# EAGLE design MotioGlove (EAGLE 7.4.0)
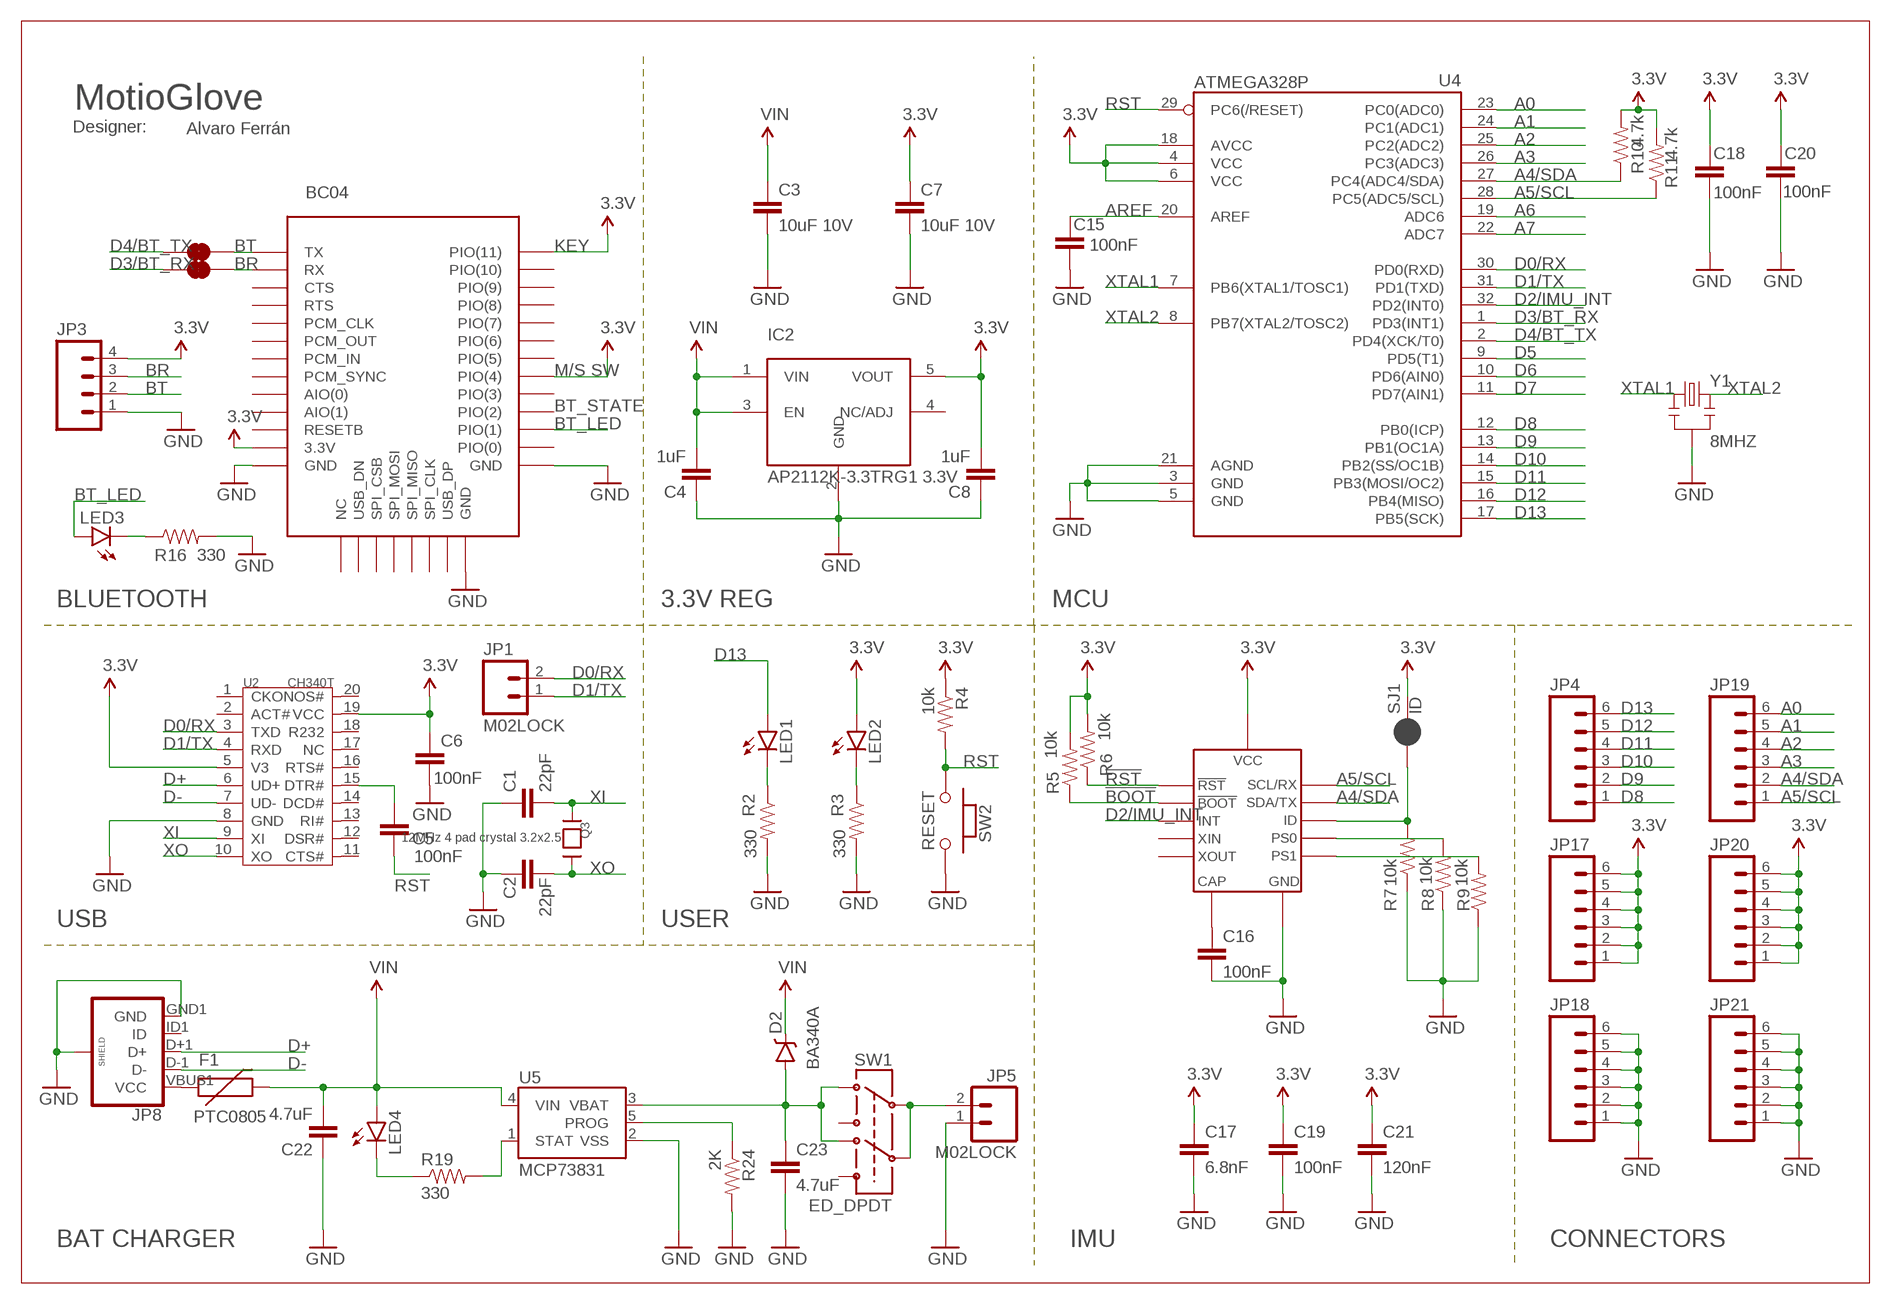
[diagram p0: schematic, sheet 1]

## Parts
C1  22pF  CAP0402-CAP  [0402-CAP]
C2  22pF  CAP0402-CAP  [0402-CAP]
C3  10uF 10V  CAP0603-CAP  [0603-CAP]
C4  1uF  CAP0603-CAP  [0603-CAP]
C5  100nF  CAP0402-CAP  [0402-CAP]
C6  100nF  CAP0402-CAP  [0402-CAP]
C7  10uF 10V  CAP0603-CAP  [0603-CAP]
C8  1uF  CAP0603-CAP  [0603-CAP]
C15  100nF  CAP0402-CAP  [0402-CAP]
C16  100nF  CAP0603-CAP  [0603-CAP]
C17  6.8nF  CAP0603-CAP  [0603-CAP]
C18  100nF  CAP0402-CAP  [0402-CAP]
C19  100nF  CAP0603-CAP  [0603-CAP]
C20  100nF  CAP0402-CAP  [0402-CAP]
C21  120nF  CAP0603-CAP  [0603-CAP]
C22  4.7uF  CAP0402-CAP  [0402-CAP]
C23  4.7uF  CAP0402-CAP  [0402-CAP]
D2  BA340A  B340A  [SMA-DIODE]
F1  PTC0805  [0805]
IC2  AP2112K-3.3TRG1 3.3V  5PIN_REG  [SOT23-5]
IC3  BC04_BLUETOOTH  [BC04]
JP1  M02LOCK  [1X02_LOCK]
JP3  M04LOCK  [1X04_LOCK]
JP4  M06LOCK  [1X06_LOCK]
JP5  M02LOCK  [1X02_LOCK]
JP8  USB_MICROB_PLUGCONN-11752  [USB-B-MICRO-SMD_V03]
JP17  M06LOCK  [1X06_LOCK]
JP18  M06LOCK  [1X06_LOCK]
JP19  M06LOCK  [1X06_LOCK]
JP20  M06LOCK  [1X06_LOCK]
JP21  M06LOCK  [1X06_LOCK]
LED1  LED0603  [LED-0603]
LED2  LED0603  [LED-0603]
LED3  LED0603  [LED-0603]
LED4  LED0603  [LED-0603]
Q3  12MHz 4 pad crystal 3.2x2.5  CRYSTAL3.2X2.5  [CRYSTAL_3.2X2.5]
R  JUMPER-PAD-2-NC_BY_TRACE  [PAD-JUMPER-2-NC_BY_TRACE_YES_SILK]
R2  330  RESISTOR0402-RES  [0402-RES]
R3  330  RESISTOR0402-RES  [0402-RES]
R4  10k  RESISTOR0402-RES  [0402-RES]
R5  10k  RESISTOR0402-RES  [0402-RES]
R6  10k  RESISTOR0402-RES  [0402-RES]
R7  10k  RESISTOR0402-RES  [0402-RES]
R8  10k  RESISTOR0402-RES  [0402-RES]
R9  10k  RESISTOR0402-RES  [0402-RES]
R10  4.7k  RESISTOR0402-RES  [0402-RES]
R11  4.7k  RESISTOR0402-RES  [0402-RES]
R16  330  RESISTOR0402-RES  [0402-RES]
R19  330  RESISTOR0402-RES  [0402-RES]
R24  2K  RESISTOR0402-RES  [0402-RES]
SJ1  ID  JUMPER-PAD-2-NC_BY_PASTE  [PAD-JUMPER-2-NC_BY_PASTE_YES_SILK]
SW1  ED_DPDT  [ED_DPDT]
SW2  RESET  PB157  [157SW]
T  JUMPER-PAD-2-NC_BY_TRACE  [PAD-JUMPER-2-NC_BY_TRACE_YES_SILK]
U2  CH340T  [SSOP20]
U3  BNO055  [BNO055]
U4  ATMEGA328P  ATMEGA328_SMT  [TQFP32-08]
U5  MCP73831  [SOT23-5]
Y1  8MHZ  RESONATOR8MHZ  [RESONATOR-SMD]

## Nets
3.3V: C6.1 C7.1 C8.2 C17.1 C18.1 C19.1 C20.1 C21.1 IC2.5(VOUT) IC3.P$12(3.3V) IC3.P$27(PIO(4)) IC3.P$34(PIO(11)) JP3.4 JP17.1 JP17.2 JP17.3 JP17.4 JP17.5 JP17.6 JP20.1 JP20.2 JP20.3 JP20.4 JP20.5 JP20.6 LED2.A R4.1 R5.2 R6.2 R10.2 R11.2 SJ1.2 U2.5(V3) U2.19(VCC) U3.3(VCC) U3.28(VCC) U4.4(VCC) U4.6(VCC) U4.18(AVCC)
!BOOT: R5.1 U3.4(BOOT)
!RST: R6.1 U3.11(RST)
A0: JP19.6 U4.23(PC0(ADC0))
A1: JP19.5 U4.24(PC1(ADC1))
A2: JP19.4 U4.25(PC2(ADC2))
A3: JP19.3 U4.26(PC3(ADC3))
A4/SDA: JP19.2 R10.1 U3.20(SDA/TX) U4.27(PC4(ADC4/SDA))
A5/SCL: JP19.1 R11.1 U3.19(SCL/RX) U4.28(PC5(ADC5/SCL))
A6: U4.19(ADC6)
A7: U4.22(ADC7)
AREF: C15.1 U4.20(AREF)
BR: IC3.P$2(RX) JP3.3 R.2
BT: IC3.P$1(TX) JP3.2 T.2
BT_LED: IC3.P$24(PIO(1)) LED3.A
D0/RX: JP1.2 U2.3(TXD) U4.30(PD0(RXD))
D1/TX: JP1.1 U2.4(RXD) U4.31(PD1(TXD))
D2/IMU_INT: U3.14(INT) U4.32(PD2(INT0))
D3/BT_RX: R.1 U4.1(PD3(INT1))
D4/BT_TX: T.1 U4.2(PD4(XCK/T0))
D5: U4.9(PD5(T1))
D6: U4.10(PD6(AIN0))
D7: U4.11(PD7(AIN1))
D8: JP4.1 U4.12(PB0(ICP))
D9: JP4.2 U4.13(PB1(OC1A))
D10: JP4.3 U4.14(PB2(SS/OC1B))
D11: JP4.4 U4.15(PB3(MOSI/OC2))
D12: JP4.5 U4.16(PB4(MISO))
D13: JP4.6 LED1.A U4.17(PB5(SCK))
D+: JP8.D+1(D+) U2.6(UD+)
D-: JP8.D-1(D-) U2.7(UD-)
GND: C1.1 C2.1 C3.2 C4.1 C6.2 C7.2 C8.1 C15.2 C16.2 C17.2 C18.2 C19.2 C20.2 C21.2 C22.1 C23.2 IC2.2(GND) IC3.P$13(GND) IC3.P$21(GND) IC3.P$22(GND) JP3.1 JP5.1 JP8.GND1(GND) JP8.SHIELD1(SHIELD) JP8.SHIELD2(SHIELD) JP8.SHIELD3(SHIELD) JP18.1 JP18.2 JP18.3 JP18.4 JP18.5 JP18.6 JP21.1 JP21.2 JP21.3 JP21.4 JP21.5 JP21.6 R2.2 R3.2 R7.1 R8.1 R9.1 R16.2 R24.2 SW2.2 U2.8(GND) U3.2(GND) U3.10(GND) U3.15(GND) U3.16(GND) U3.18(GND) U3.25(GND) U4.3(GND) U4.5(GND) U4.21(AGND) U5.2(VSS) Y1.2
N$1: C5.1 U2.15(DTR#)
N$2: R7.2 SJ1.1 U3.17(ID)
N$3: JP5.2 SW1.2 SW1.5
N$4: F1.1 JP8.VBUS1(VCC)
N$5: R8.2 U3.6(PS0)
N$6: R9.2 U3.5(PS1)
N$7: LED1.C R2.1
N$9: C16.1 U3.9(CAP)
N$10: R19.2 U5.1(STAT)
N$11: LED3.C R16.1
N$14: LED4.C R19.1
N$18: LED2.C R3.1
PROG: R24.1 U5.5(PROG)
RST: C5.2 R4.2 SW2.1 U4.29(PC6(/RESET))
VBAT: C23.1 D2.A SW1.1 SW1.4 U5.3(VBAT)
VIN: C3.1 C4.2 C22.2 D2.C F1.2 IC2.1(VIN) IC2.3(EN) LED4.A U5.4(VIN)
XI: C1.2 Q3.3 U2.9(XI)
XO: C2.2 Q3.1 U2.10(XO)
XTAL1: U4.7(PB6(XTAL1/TOSC1)) Y1.1
XTAL2: U4.8(PB7(XTAL2/TOSC2)) Y1.3
Unconnected: IC2.4(NC/ADJ) IC3.P$3(CTS) IC3.P$4(RTS) IC3.P$5(PCM_CLK) IC3.P$6(PCM_OUT) IC3.P$7(PCM_IN) IC3.P$8(PCM_SYNC) IC3.P$9(AIO(0)) IC3.P$10(AIO(1)) IC3.P$11(RESETB) IC3.P$14(NC) IC3.P$15(USB_DN) IC3.P$16(SPI_CSB) IC3.P$17(SPI_MOSI) IC3.P$18(SPI_MISO) IC3.P$19(SPI_CLK) IC3.P$20(USB_DP) IC3.P$23(PIO(0)) IC3.P$25(PIO(2)) IC3.P$26(PIO(3)) IC3.P$28(PIO(5)) IC3.P$29(PIO(6)) IC3.P$30(PIO(7)) IC3.P$31(PIO(8)) IC3.P$32(PIO(9)) IC3.P$33(PIO(10)) JP8.ID1(ID) SW1.3 SW1.6 U2.1(CKO) U2.2(ACT#) U2.11(CTS#) U2.12(DSR#) U2.13(RI#) U2.14(DCD#) U2.16(RTS#) U2.17(NC) U2.18(R232) U2.20(NOS#) U3.26(XOUT) U3.27(XIN)

## Notes on the sheet
- MotioGlove
- Designer: | Alvaro Ferrán
- BC04
- KEY
- M/S SW
- BT_STATE
- BLUETOOTH | 3.3V REG | MCU
- USB | USER
- BAT CHARGER | IMU | CONNECTORS

## Library data of the parts
C1-C8 C15-C23 = SparkFun-Passives:CAP: Capacitor Standard 0603 ceramic capacitor, and 0.1" leaded capacitor.
D2 = SparkFun-DiscreteSemi:B340A: Schottky Diode 3A-40V; PROD_ID: DIO-09886
F1 = pighiXXX:PTC0805
IC2 = GHI:5PIN_REG
IC3 = bc04:BC04_BLUETOOTH; IC: BC04
JP1 JP5 = SparkFun-Connectors:M02: Standard 2-pin 0.1" header. Use with - straight break away headers ( PRT-00116) - right angle break away headers (PRT-00553) - swiss pins (PRT-00743) - machine pins (PRT-00117) - female headers (PRT-00115) Molex polarized connector foot print use with: PRT-08233 with associated crimp pins and housings. 2.54_SCREWTERM for use with PRT-10571. 3.5mm Screw Terminal footprints for PRT-08084 5mm Screw Terminal footprints for use with PRT-08432
JP3 = SparkFun-Connectors:M04: Header 4 Standard 4-pin 0.1" header. Use with straight break away headers (SKU : PRT-00116), right angle break away headers (PRT-00553), swiss pins (PRT-00743), machine pins (PRT-00117), and female headers (PRT-00115). Molex polarized connector foot print use with SKU : PRT-08231 with associated crimp pins and housings. 1MM SMD Version SKU: PRT-10208
JP4 JP17-JP21 = SparkFun-Connectors:M06: Header 6 Standard 6-pin 0.1" header. Use with straight break away headers (SKU : PRT-00116), right angle break away headers (PRT-00553), swiss pins (PRT-00743), machine pins (PRT-00117), and female headers (PRT-00115). Molex polarized connector foot print use with SKU : PRT-08094 with associated crimp pins and housings. NOTES ON THE VARIANTS LOCK and LOCK_LONGPADS... This footprint was designed to help hold the alignment of a through-hole component (i.e. 6-pin header) while soldering it into place. You may notice that each hole has been shifted either up or down by 0.005 of an inch from it's more standard position (which is a perfectly straight line). This slight alteration caused the pins (the squares in the middle) to touch the edges of the holes. Because they are alternating, it causes a "brace" to hold the component in place. 0.005 has proven to be the perfect amount of "off-center" position when using our standard breakaway headers. Although looks a little odd when you look at the bare footprint, once you have a header in there, the alteration is very hard to notice. Also,if you push a header all the way into place, it is covered up entirely on the bottom side. This idea of altering the position of holes to aid alignment will be further integrated into the Sparkfun Library for other footprints. It can help hold any component with 3 or more connection pins.
JP8 = SparkFun-Connectors:USB_MICROB_PLUG: USB Micro-B connectors Some male, some female. Watch your step!; PROD_ID: CONN-11752
LED1-LED4 = SparkFun-LED:LED: LEDs Standard schematic elements and footprints for 5mm, 3mm, 1206, and 0603 sized LEDs. 5mm - Spark Fun Electronics SKU : COM-00529 (and others)
Q3 = GHI:CRYSTAL3.2X2.5
R T = SparkFun-Passives:JUMPER-PAD-2-NC_BY_TRACE
R2-R11 R16 R19 R24 = SparkFun-Passives:RESISTOR: Resistor Basic schematic elements and footprints for 0603, 1206, and PTH resistors.
SJ1 = SparkFun-Passives:JUMPER-PAD-2-NC_BY_PASTE
SW1 = pighiXXX:ED_DPDT
SW2 = MySMD:PB157
U2 = template:CH340T
U3 = alvaroferran:BNO055: The BNO055 is a System in Package (SiP), integrating a triaxial 14-bit accelerometer, a triaxial 16-bit gyroscope with a range of ±2000 degrees per second, a triaxial geomagnetic sensor and a 32-bit microcontroller running the company’s BSX3.0 FusionLib software. At just 5.2 x 3.8 x 1.1 mm3, it is significantly smaller than comparable discrete or system-on-board solutions.
U4 = SparkFun-DigitalIC:ATMEGA328_SMT: 32-Pin Atmega328 part Commonly used on Arduino compatible boards Available in QFP and QFN packages TQFP is IC-09069 QFN is non-stock; PROD_ID: IC-09069
U5 = SparkFun-PowerIC:MCP73831: Miniature single cell, fully integrated Li-Ion, Li-polymer charge management controller http://ww1.microchip.com/downloads/en/DeviceDoc/21984a.pdf IC-09995; PROD_ID: IC-09995
Y1 = SparkFun-FreqCtrl:RESONATOR: Resonator Small SMD resonator. Used, eg, on the Arduino Pro/ Pro Mini boards. 8MHz- XTAL-08895 16MHz- XTAL-08900; PROD_ID: XTAL-08895

## Net classes
0 default: width 0.254 mm, drill 0.254 mm, clearance 0.203 mm

## Board
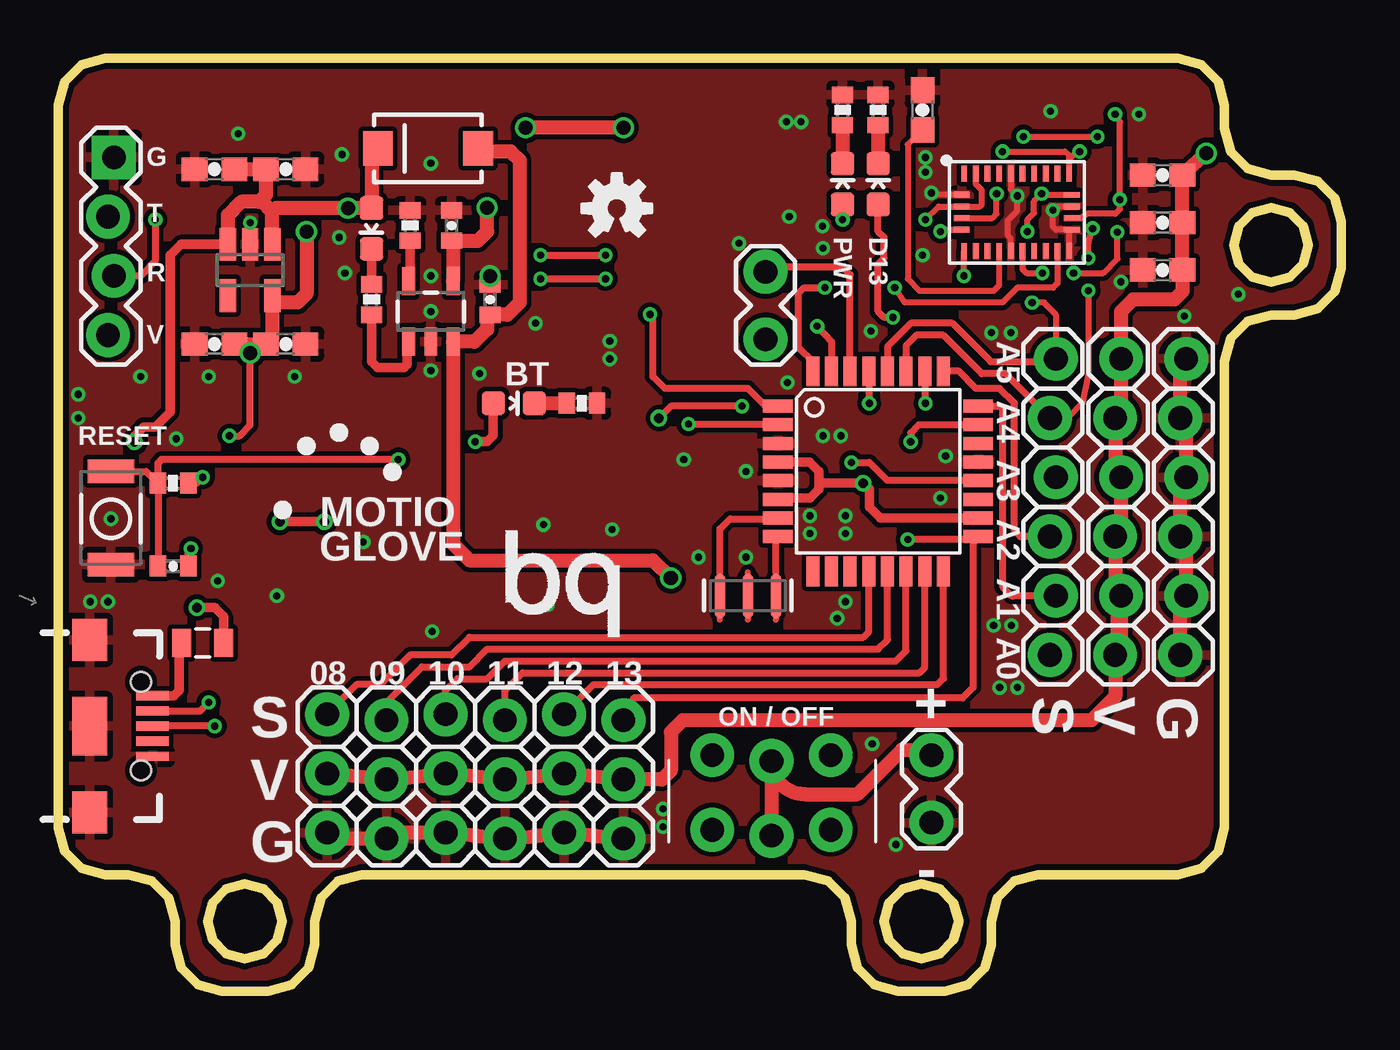
[diagram p1: board, top side]
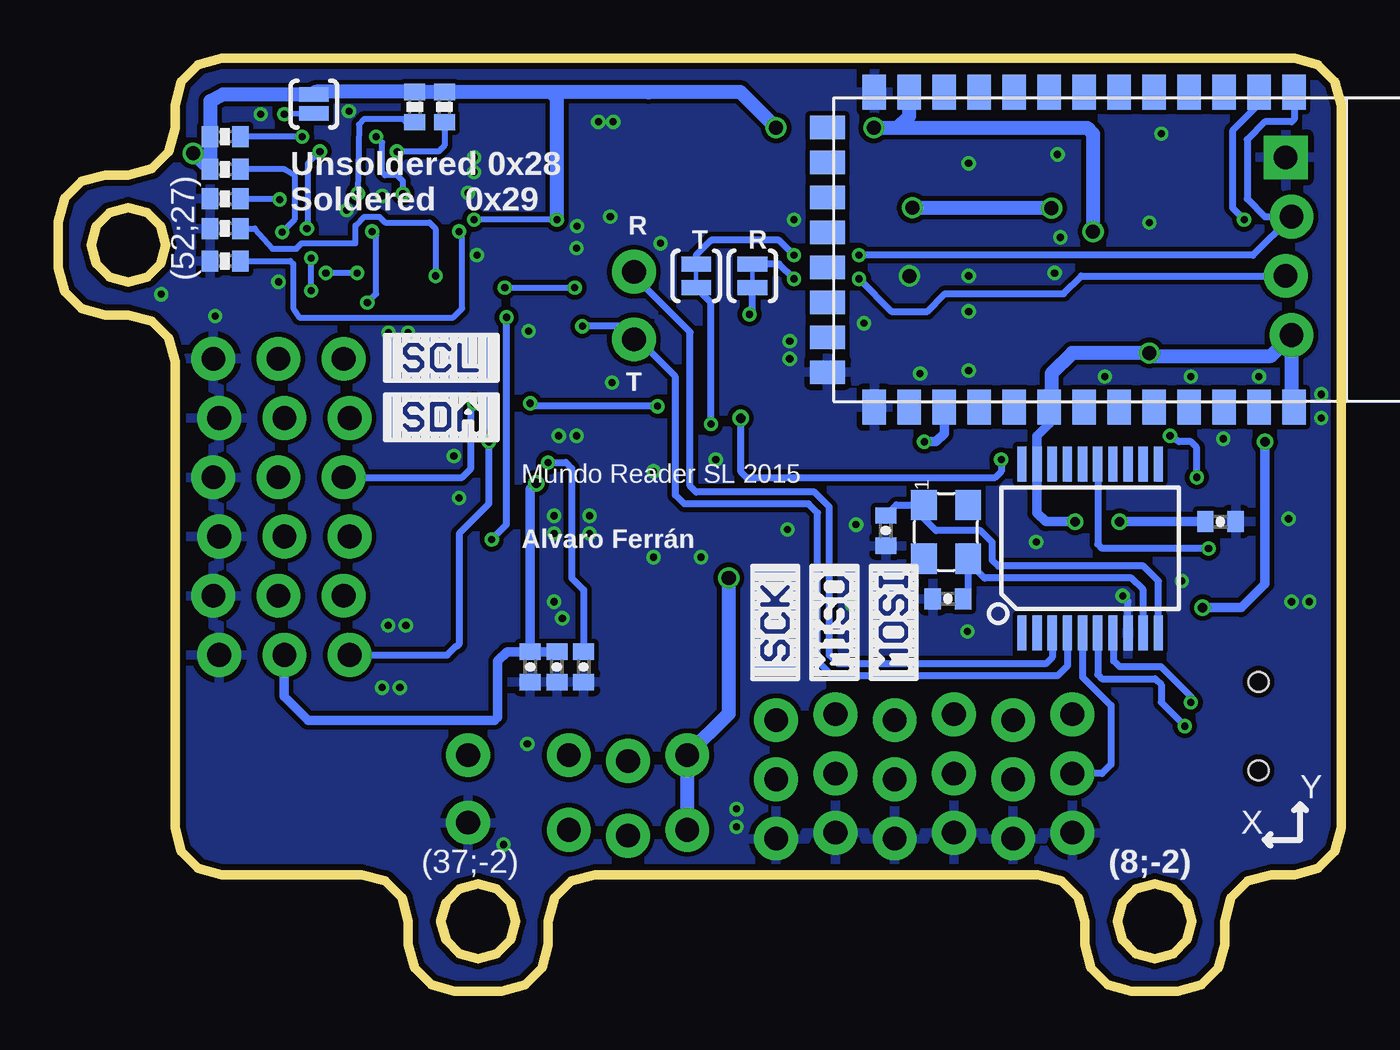
[diagram p2: board, bottom side, seen from below]

Size 55 x 40 mm. Coordinates in mm from the lower left corner, seen from the top.
Outline: 9.39,2.2 9.6,3 9.39,3.8 8.8,4.39 8,4.6 7.2,4.39 6.61,3.8 6.4,3 6.61,2.2 7.2,1.61 8,1.4 8.8,1.61 9.39,2.2
Outline: 38.39,2.2 38.6,3 38.39,3.8 37.8,4.39 37,4.6 36.2,4.39 35.61,3.8 35.4,3 35.61,2.2 36.2,1.61 37,1.4 37.8,1.61 38.39,2.2
Outline: 53.39,31.2 53.6,32 53.39,32.8 52.8,33.39 52,33.6 51.2,33.39 50.61,32.8 50.4,32 50.61,31.2 51.2,30.62 52,30.4 52.8,30.62 53.39,31.2
Outline: 40.27,4 40,3 40,2 39.73,1 39,0.27 38,0 36,0 35,0.27 34.27,1 34,2 34,3 33.73,4 33,4.73 32,5 13,5 12,4.73 11.27,4 11,3 11,2 10.73,1 10,0.27 9,0 7,0 6,0.27 5.27,1 5,2 5,3 4.73,4 4,4.73 3,5 2,5 1,5.27 0.27,6 0,7 0,38 0.27,39 1,39.73 2,40 48,40 49,39.73 49.73,39 50,38 50,37 50.27,36 51,35.27 52,35 53,35 54,34.73 54.73,34 55,33 55,31 54.73,30 54,29.27 53,29 52,29 51,28.73 50.27,28 50,27 50,7 49.73,6 49,5.27 48,5 42,5 41,4.73 40.27,4
Copper layers (1*16): Top 0.035mm / dielectric 1.5mm / Bottom 0.035mm
Design rules "pighixxx_CAM_DRC_V1.0": minimum track width 6mil, minimum drill 12mil, track to track 6mil, track to pad 6mil, pad to pad 6mil, via to via 6mil, smd to smd 0mil, copper to edge 10mil, drill to drill 10mil, minimum pad ring 10mil, minimum via ring 6mil, stop-mask expansion 2mil, vias tented up to drill 100mil, thermal gap 10mil

### Footprints (pad centres in the part's own frame; a part is rotated, then mirrored left to right if it is on the bottom)
0402-CAP = smd 0.7 x 0.9: 1 -0.65,0; 2 0.65,0
0603-CAP = smd 1.1 x 1: 1 -0.85,0; 2 0.85,0
SMA-DIODE = smd 1.27 x 1.47: A -2.15,0; C 2.15,0
0805 = smd 0.8 x 1.2: 1 -0.9,0; 2 0.9,0
SOT23-5 = smd 0.7 x 1.4: 1 0.95,1.1; 2 0,1.1; 3 -0.95,1.1; 4 -0.95,-1.1; 5 0.95,-1.1
BC04 = smd 1 x 1.5: P$1 7,-0.25; P$2 8.5,-0.25; P$3 10,-0.25; P$4 11.5,-0.25; P$5 13,-0.25; P$6 14.5,-0.25; P$7 16,-0.25; P$8 17.5,-0.25; P$9 19,-0.25; P$10 20.5,-0.25; P$11 22,-0.25; P$12 23.5,-0.25; P$13 25,-0.25; P$22 25,13.25; P$23 23.5,13.25; P$24 22,13.25; P$25 20.5,13.25; P$26 19,13.25; P$27 17.5,13.25; P$28 16,13.25; P$29 14.5,13.25; P$30 13,13.25; P$31 11.5,13.25; P$32 10,13.25; P$33 8.5,13.25; P$34 7,13.25 | smd 1.5 x 1: P$14 27,1.25; P$15 27,2.75; P$16 27,4.25; P$17 27,5.75; P$18 27,7.25; P$19 27,8.75; P$20 27,10.25; P$21 27,11.75
1X02_LOCK = drill 1.016 pad 1.88: 1 -0.178,0; 2 2.718,0
1X04_LOCK = drill 1.016 pad 1.88 square: 1 0,0.127 | drill 1.016 pad 1.88: 2 2.54,-0.127; 3 5.08,0.127; 4 7.62,-0.127
1X06_LOCK = drill 1.016 pad 1.88: 1 0,0; 2 2.54,-0.254; 3 5.08,0; 4 7.62,-0.254; 5 10.16,0; 6 12.7,-0.254
USB-B-MICRO-SMD_V03 = smd 1.4 x 0.4: D+1 2.7,0; D-1 2.7,0.65; GND1 2.7,-1.3; ID1 2.7,-0.65; VBUS1 2.7,1.3 | smd 1.5 x 1.8: SHIELD1 0,3.7; SHIELD2 0,-3.7 | smd 1.5 x 2.5: SHIELD3 0,0 | hole 0.85: 2.2,1.9; 2.2,-1.9
LED-0603 = smd 1 x 1: A 0,-0.877; C 0,0.877
CRYSTAL_3.2X2.5 = smd 1.3 x 1.1: 1 -1.1,-0.9; 2 1.2,-0.9; 3 1.2,1; 4 -1.1,1
PAD-JUMPER-2-NC_BY_TRACE_YES_SILK = smd 0.635 x 1.27: 1 -0.508,0; 2 0.508,0
0402-RES = smd 0.7 x 0.9: 1 -0.65,0; 2 0.65,0
PAD-JUMPER-2-NC_BY_PASTE_YES_SILK = smd 0.635 x 1.27: 1 -0.401,0; 2 0.413,0
ED_DPDT = drill 1.016 pad 1.88: 1 -2.54,-1.397; 2 0,-1.651; 3 2.54,-1.397; 4 -2.54,1.803; 5 0,1.549; 6 2.54,1.803
157SW = smd 1.016 x 1.981: 1 0,0; 2 4,0
SSOP20 = smd 0.4 x 1.5: 1 -2.925,-3.625; 2 -2.275,-3.625; 3 -1.625,-3.625; 4 -0.975,-3.625; 5 -0.325,-3.625; 6 0.325,-3.625; 7 0.975,-3.625; 8 1.625,-3.625; 9 2.275,-3.625; 10 2.925,-3.625; 11 2.925,3.625; 12 2.275,3.625; 13 1.625,3.625; 14 0.975,3.625; 15 0.325,3.625; 16 -0.325,3.625; 17 -0.975,3.625; 18 -1.625,3.625; 19 -2.275,3.625; 20 -2.925,3.625
BNO055 = smd 0.25 x 0.68: 1 -2.279,1.72; 6 -2.279,-1.606; 7 -1.779,-1.606; 8 -1.279,-1.606; 9 -0.779,-1.606; 10 -0.279,-1.606; 11 0.221,-1.606; 12 0.721,-1.606; 13 1.221,-1.606; 14 1.721,-1.606; 15 2.221,-1.606; 20 2.221,1.72; 21 1.721,1.72; 22 1.221,1.72; 23 0.721,1.72; 24 0.221,1.72; 25 -0.279,1.72; 26 -0.779,1.72; 27 -1.279,1.72; 28 -1.779,1.72 | smd 0.68 x 0.25: 2 -2.387,0.809; 3 -2.387,0.309; 4 -2.387,-0.191; 5 -2.387,-0.691; 16 2.332,-0.692; 17 2.332,-0.192; 18 2.332,0.308; 19 2.332,0.808
TQFP32-08 = smd 1.27 x 0.559: 1 -4.293,2.8; 2 -4.293,2; 3 -4.293,1.2; 4 -4.293,0.4; 5 -4.293,-0.4; 6 -4.293,-1.2; 7 -4.293,-2; 8 -4.293,-2.8; 17 4.293,-2.8; 18 4.293,-2; 19 4.293,-1.2; 20 4.293,-0.4; 21 4.293,0.4; 22 4.293,1.2; 23 4.293,2; 24 4.293,2.8 | smd 0.559 x 1.27: 9 -2.8,-4.293; 10 -2,-4.293; 11 -1.2,-4.293; 12 -0.4,-4.293; 13 0.4,-4.293; 14 1.2,-4.293; 15 2,-4.293; 16 2.8,-4.293; 25 2.8,4.293; 26 2,4.293; 27 1.2,4.293; 28 0.4,4.293; 29 -0.4,4.293; 30 -1.2,4.293; 31 -2,4.293; 32 -2.8,4.293
SOT23-5' = smd 0.55 x 1.2: 1 -0.95,-1.3; 2 0,-1.3; 3 0.95,-1.3; 4 0.95,1.3; 5 -0.95,1.3
RESONATOR-SMD = smd 0.45 x 1.905: 1 -1.2,0; 2 0,0; 3 1.2,0

### Placement (x,y rotation side)
C1  16.86,16.83 0 bottom
C2  19.53,19.75 90 bottom
C3  9.75,35.24 0 top
C4  6.7,35.24 0 top
C5  4.92,18.23 180 top
C6  5.18,20.13 0 bottom
C7  9.75,27.75 0 top
C8  6.7,27.75 0 top
C15  32.48,13.91 270 bottom
C16  37.05,37.78 90 top
C17  47.34,34.99 180 top
C18  33.62,13.91 270 bottom
C19  47.34,32.96 180 top
C20  34.77,13.91 270 bottom
C21  47.34,30.93 180 top
C22  16.86,32.83 270 top
C23  18.51,29.66 90 top
D2  15.84,36.13 180 top
F1  6.19,14.92 0 top
IC2  8.22,30.93 0 top
IC3  -4.98,38.29 180 bottom
JP1  30.32,28.13 90 top
JP3  2.25,35.75 270 top
JP4  11.53,11.88 0 top
JP5  37.43,7.41 90 top
JP8  1.34,11.37 0 top
JP17  11.53,9.34 0 top
JP18  11.53,6.8 0 top
JP19  42.77,27.12 270 top
JP20  45.31,14.42 90 top
JP21  48.1,14.42 90 top
LED1  35.15,34.61 0 top
LED2  33.62,34.61 0 top
LED3  19.53,25.21 270 top
LED4  13.43,32.7 180 top
Q3  16.99,19.75 270 bottom
R  25.24,30.67 90 bottom
R2  35.15,37.78 90 top
R3  33.62,37.78 90 top
R4  4.92,21.78 180 top
R5  47.85,36.64 180 bottom
R6  47.85,35.24 180 bottom
R7  47.85,33.97 0 bottom
R8  47.85,32.7 0 bottom
R9  47.85,31.31 0 bottom
R10  38.45,37.91 90 bottom
R11  39.72,37.91 90 bottom
R16  22.45,25.21 0 top
R19  13.43,29.66 270 top
R24  15.08,32.83 90 top
SJ1  44.04,38.04 90 bottom
SW1  30.58,8.32 0 top
SW2  2.25,22.29 270 top
T  27.65,30.67 90 bottom
U2  10.76,18.99 0 bottom
U3  41.12,33.34 0 top
U4  35.15,22.29 0 top
U5  MCP73831  [SOT23-5']  15.97,29.15 0 top
U$1  [BQ_LOGO_1]  21.56,16.19 0 top
U$2  [S_SDA]  40.99,25.59 270 bottom
U$3  [OSHW-LOGO-S]  23.95,33.57 0 top
U$4  [BQ_LOGO_SMALL_2]  9.24,20 0 top
U$5  [S_SCL]  40.99,28.13 270 bottom
U$6  [S_MOSI]  20.16,13.4 0 bottom
U$7  [S_MISO]  22.7,13.4 0 bottom
U$8  [S_SCK]  25.24,13.4 0 bottom
Y1  29.56,16.96 0 top

### Tracks (layer width: path | path; a pad name or v marks a point on that pad's centre or on a via)
3.3V  (via drill 0.3, 0.41, 0.6, 0.61)
  Top 0.254: v37.18,33.09 37.74,33.65 U3.3 39.52,33.65 39.59,33.72 39.59,34.36 39.34,34.61 U3.28
  Top 0.305: R4.1 5.94,21.78 v6.19,22.04 | v7.33,23.81 7.77,23.81 8.22,24.27 v8.22,27.37
  Top 0.406: U4.4 32.21,22.69 32.61,22.29 32.61,21.91 | 32.61,21.91 32.61,21.53 32.23,21.15 30.91,21.15 U4.6 | 32.61,21.91 32.73,21.78 v34.51,21.78 34.77,21.53 34.77,20.77 35.24,20.29 U4.18 | JP20.3 JP20.1 | v9.49,20.13 v11.4,20.13
  Top 0.61: JP17.1 11.78,9.34 JP17.2 14.32,9.08 JP17.3 16.86,9.34 JP17.4 19.4,9.08 JP17.5 21.94,9.34 JP17.6 25.88,9.08 26.26,9.46 26.26,11.11 26.77,11.62 44.29,11.62 45.31,12.64 JP20.1 45.56,14.67 JP20.2 45.31,17.21 JP20.3 45.56,19.75 JP20.4 45.31,22.29 JP20.5 45.56,24.83 JP20.6 45.56,29.15 46.07,29.66 47.85,29.66 48.19,30 C21.1 C19.1 C17.1 48.44,35.24 v49.22,35.93 | LED2.A v33.62,33.09 | C8.2 C7.1 | C7.1 9.17,28.03 IC2.5 9.47,29.53 10.26,29.53 10.64,29.91 v10.64,32.58 | C7.1 8.6,27.75 v8.22,27.37 | v24.23,37.02 v20.03,37.02
  Bottom 0.254: v33.62,33.09 v37.18,33.09
  Bottom 0.305: v6.19,22.04 6.19,23.31 6.45,23.56 6.95,23.56 v7.33,23.81 | U2.5 11.09,13.47 9.87,12.26 9.87,9.72 10.26,9.34 JP17.1
  Bottom 0.406: C18.1 C20.1 | C20.1 34.77,21.53 v34.51,21.78 | C20.1 35.77,14.56 36.16,14.16 36.16,11.75 36.29,11.62 44.29,11.62 45.31,12.64 JP20.1 | R10.2 38.56,38.45 | 48.48,36.78 R5.2 | IC3.P$34 2.13,25.04 | IC3.P$27 12.52,24.35 13.05,23.81 13.05,22.62 U2.19 13.05,22.6 13.05,20.51 12.67,20.13 v11.4,20.13 | C6.1 v9.49,20.13
  Bottom 0.61: R5.2 R6.2 v49.22,35.93 | 48.48,36.78 48.48,38.17 47.94,38.45 SJ1.2 arc90 43.93,38.56 R11.2 R10.2 33.89,38.56 | v33.62,33.09 33.62,38.29 33.88,38.55 arc-90 33.89,38.56 | 33.89,38.56 29.7,38.56 | 29.7,38.56 29.69,38.55 | IC3.P$27 12.41,25.14 12.41,26.48 11.53,27.37 v8.22,27.37 8.22,27.24 3.02,27.24 JP3.4 2.13,25.04 | 29.7,38.56 25.76,38.56 v24.23,37.02 | v10.64,32.58 10.64,36.77 10.89,37.02 v20.03,37.02 19.02,37.02 18.51,37.53 IC3.P$12
!BOOT  (via drill 0.3)
  Top 0.254: U3.4 40.04,33.15 40.23,33.34 v40.23,34.2 | v41.37,36.64 v44.55,36.64
  Bottom 0.254: v40.23,34.2 40.23,34.74 40.48,34.99 40.99,34.99 41.12,35.12 41.12,36.39 v41.37,36.64 | v44.55,36.64 R5.1
!RST  (via drill 0.3)
  Top 0.254: U3.11 41.34,30.96 41.5,30.8 v42.18,30.8 | v43.53,30.8 44.8,30.8 45.41,31.41 v45.41,32.55
  Bottom 0.254: v42.18,30.8 v43.53,30.8 | R6.1 45.31,35.24 44.88,34.97 44.88,33.09 v45.41,32.55
A0  (via drill 0.3)
  Top 0.305: U4.23 36.89,24.29 36.54,23.94 v36.54,23.56
  Bottom 0.305: JP19.6 38.32,14.42 37.94,14.8 arc-90 37.81,14.92 37.81,19.62 36.54,20.89 v36.54,23.56
A1
  Top 0.305: JP19.5 40.99,16.96 40.86,16.96 40.48,17.34 40.48,24.96 40.35,25.08 U4.24
A2
  Top 0.305: JP19.4 41.24,19.5 40.99,19.75 40.99,25.21 40.35,25.85 39.34,25.85 38.6,26.58 U4.25
A3  (via drill 0.3)
  Top 0.305: v37.18,25.21 37.18,26.55 U4.26
  Bottom 0.305: JP19.3 37.69,22.04 37.31,22.42 37.31,25.08 v37.18,25.21
A4/SDA  (via drill 0.3)
  Top 0.254: v44.16,30.04 44.16,26.48 43.91,25.21 43.28,24.58 JP19.2 | v40.48,36.01 43.15,36.01 43.34,35.82 U3.20 43.34,35.69 43.66,36.01 v43.78,36.01 | v44.16,31.43 44.16,32.07 v44.34,32.7
  Top 0.305: JP19.2 40.61,26.48 39.59,26.48 37.94,28.13 36.8,28.13 36.35,27.68 U4.27
  Bottom 0.254: R10.1 38.45,36.26 38.7,36.01 v40.48,36.01 | v43.78,36.01 44.29,35.5 44.29,32.96 44.52,32.7 v44.34,32.7 | v44.16,30.04 v44.16,31.43
A5/SCL  (via drill 0.3)
  Top 0.254: U3.19 42.34,34.15 v42.16,34.2 41.83,33.87 41.83,33.36 41.55,33.09 v41.55,32.58 | v41.75,29.53 42.26,29.53 42.77,29.02 JP19.1
  Top 0.305: U4.28 35.55,27.64 36.54,28.64 38.32,28.64 39.97,26.99 42.64,26.99 JP19.1
  Bottom 0.254: 39.73,37.28 R11.1 40.09,37.26 40.23,37.4 41.88,37.4 42.11,37.17 v42.16,34.2 | v41.75,29.53 41.37,29.91 41.37,32.4 v41.55,32.58
AREF  (via drill 0.3)
  Top 0.305: 39.42,21.91 35.53,21.91 34.77,22.67 v34,22.67
  Top 0.406: 39.42,21.91 U4.20
  Bottom 0.305: v34,22.67 33.24,22.67 32.99,22.42 32.99,17.72 32.48,17.21 C15.1
BR  (via drill 0.3)
  Top 0.305: v4.16,33.09 4.16,31.31 3.52,30.67 JP3.3 | v20.67,30.55 v23.46,30.55
  Bottom 0.254: IC3.P$2 3.52,38.05
  Bottom 0.305: 3.52,38.05 4.67,36.9 4.67,33.59 v4.16,33.09 | v23.46,30.55 24.1,31.18 R.2 | v20.67,30.55 19.27,29.15 17.75,29.15 16.99,29.91 11.91,29.91 11.14,30.67 JP3.3
BT  (via drill 0.3)
  Top 0.305: v20.67,31.56 v23.46,31.56
  Bottom 0.305: IC3.P$1 2.02,37.39 2.13,37.28 3.27,37.28 4.03,36.51 4.03,33.97 3.27,33.21 JP3.2 3.78,31.56 v20.67,31.56 | v23.46,31.56 24.1,32.2 27.02,32.2 27.65,31.56 T.2
BT_LED  (via drill 0.3)
  Top 0.406: LED3.A 18.65,23.83 18.38,23.56 v17.88,23.56
  Bottom 0.305: 17.24,24.82 IC3.P$24
  Bottom 0.406: v17.88,23.56 17.37,23.56 17.02,23.91 IC3.P$24
D0/RX
  Top 0.305: 34,26.64 U4.30 33.95,30.73 33.62,31.05 30.52,31.05 JP1.2
  Bottom 0.305: U2.3 12.39,14.32 12.67,14.04 21.56,14.04 21.94,14.42 21.94,20.77 22.57,21.4 27.65,21.4 27.91,21.66 27.91,28.26 30.32,30.67 JP1.2
D1/TX  (via drill 0.3)
  Top 0.305: v32.53,28.51 33.15,27.85 U4.31
  Bottom 0.305: U2.4 11.74,13.95 12.16,13.53 21.81,13.53 22.45,14.16 22.45,20.51 22.83,20.89 28.16,20.89 28.54,21.27 28.54,26.35 30.14,27.95 JP1.1 30.88,28.51 v32.53,28.51
D2/IMU_INT  (via drill 0.3)
  Top 0.254: U3.14 42.84,30.36 42.64,30.16 41.12,30.16 40.48,29.53 36.29,29.53 v35.86,30.16
  Top 0.305: U4.32 32.35,27 31.72,27.62 31.72,29.91 31.97,30.16 v32.86,30.16
  Bottom 0.254: v35.86,30.16 v32.86,30.16
D3/BT_RX  (via drill 0.3)
  Top 0.305: U4.1 30.32,25.09 29.56,25.85 26,25.85 25.5,26.35 25.5,28.89 v25.37,29.02
  Bottom 0.305: v25.37,29.02 25.24,29.15 R.1
D4/BT_TX  (via drill 0.3)
  Top 0.305: U4.2 27.18,24.29 v27.02,24.32
  Bottom 0.305: v27.02,24.32 27.02,29.53 T.1
D8
  Top 0.305: U4.12 34.75,15.41 34.51,15.18 17.62,15.18 16.86,14.42 15.08,14.42 13.81,13.15 12.8,13.15 JP4.1
D9
  Top 0.305: JP4.2 14.07,12.38 15.59,13.91 17.62,13.91 18.38,14.67 35.15,14.67 35.55,15.07 U4.13
D10
  Top 0.305: JP4.3 16.61,12.89 17.11,13.4 18.38,13.4 19.15,14.16 35.91,14.16 36.35,14.6 U4.14
D11
  Top 0.305: JP4.4 19.15,12.89 19.91,13.65 36.93,13.65 37.15,13.88 U4.15
D12
  Top 0.305: JP4.5 22.96,13.15 37.69,13.15 37.95,13.41 U4.16
D13  (via drill 0.3)
  Top 0.305: JP4.6 24.67,12.57 38.77,12.57 39.21,13.02 39.21,19.26 U4.17 39.73,19.49 | 39.32,19.37 v36.42,19.37 | v35.78,28.89 35.4,28.89 35.15,29.15 35.15,31.18 35.4,31.43 35.4,32.32 35.15,32.58 LED1.A
  Top 0.406: U4.17 39.32,19.37
  Bottom 0.305: v36.42,19.37 35.78,20 v35.78,28.89
D+  (via drill 0.3)
  Top 0.305: v6.7,11.37 JP8.D+1
  Bottom 0.305: U2.6 10.44,13.58 10.26,13.4 7.97,13.4 7.72,13.15 7.72,12.38 v6.7,11.37
D-  (via drill 0.3)
  Top 0.305: JP8.D-1 6.08,12.02 v6.45,12.38
  Bottom 0.305: v6.45,12.38 6.45,12.64 7.72,13.91 9.49,13.91 9.75,14.16 9.75,15.32 U2.7
GND  (via drill 0.3, 0.6)
  Top 0.254: U3.25 40.84,34.38 v41.12,34.1 41.12,33.47 40.71,33.06 40.71,32.4 40.84,32.27 U3.10 | U3.2 37.51,34.15 v37.43,34.23 | U3.15 43.34,32.54 U3.16 42.77,32.65 42.64,32.78 v42.64,33.49 42.69,33.65 U3.18
  Top 0.61: JP18.6 21.94,6.8 JP18.5 19.4,6.54 JP18.4 16.86,6.8 JP18.3 14.32,6.8 JP18.2 11.78,6.54 JP18.1 | JP21.1 48.1,16.7 JP21.2 48.36,19.24 JP21.3 48.1,21.78 JP21.4 48.36,24.32 JP21.5 48.1,26.86 JP21.6 | C23.2 18.56,30.36 v18.51,30.67
  Bottom 0.305: U2.8 9.14,16.73 v9.37,16.96
  other vias: 0.86,25.59 0.86,24.58 5.05,23.69 16.02,15.43 29.48,18.61 32.79,23.81 25.93,7.81 2.25,20.26 20.8,20 29.18,32.07 31.34,33.21 32.76,32.81 32.79,31.87 33.75,20.39 40.86,15.69 40.35,13.02 33.75,16.7 20.97,16.58 29.48,22.29 31.26,26.1 34.89,10.61 32.23,19.62 32.23,20.39 33.75,19.62 33.55,23.81 37.81,21.15 37.05,31.56 40.84,28.23 25.93,7.05 35.91,6.29 41.12,13.02 40.1,15.69 40,28.23 48.28,28.95 50.59,29.88 45.56,30.42 37.18,35.75 31.85,37.28 38.04,22.95 42.54,37.73 37.18,35.12 34.84,28.31 31.21,37.28 1.37,16.7 23.74,19.8 7.72,36.77 23.46,33.09 27.45,18.61 23.64,27.88 13.08,19.27 46.32,37.61 8.22,32.96 23.64,27.12 18.05,26.48 20.47,28.64 15.97,26.61 15.97,29.15 6.83,17.59 2.13,16.7 33.4,15.99 15.97,30.67 12.29,30.8 12.16,35.88 12.03,32.32 15.97,35.5 26.82,22.8 3.52,26.35 6.45,26.35 10.13,26.35
  pour Top: -0.92,40.32 55.09,40.58 54.71,-0.32 -1.3,-0.57
  pour Bottom: -1.43,40.32 55.34,40.71 54.83,-0.32 -1.43,-0.7
N$1  (via drill 0.3)
  Top 0.305: C5.1 5.57,18.88 v5.68,18.99
  Bottom 0.305: v5.68,18.99 10.26,18.99 10.44,19.17 U2.15
N$2  (via drill 0.3)
  Top 0.254: 45.41,37.51 v45.31,37.61 45.51,37.28 v45.51,33.95 45.51,33.54 45.31,33.34 44.09,33.34 43.85,33.15 U3.17
  Bottom 0.254: SJ1.1 44.06,37.66 v45.31,37.61 | R7.2 45.66,33.97 v45.51,33.95
N$3
  Top 0.61: SW1.2 SW1.5 arc90 32,8.45 34.26,8.45 36.16,10.35 37.2,10.35 arc-90 JP5.2
N$4
  Top 0.406: JP8.VBUS1 4.95,12.67 5.18,12.89 5.18,14.81 F1.1
N$5  (via drill 0.3)
  Top 0.254: v38.83,30.67 38.83,31.73 U3.6
  Bottom 0.254: R8.2 46.58,32.7 45.82,31.84 44.8,31.84 44.57,32.07 42.26,32.07 42.26,32.83 41.88,33.21 41.24,33.21 40.99,32.96 39.08,32.96 38.83,32.7 v38.83,30.67
N$6  (via drill 0.3)
  Top 0.254: v37.81,32.58 37.89,32.65 U3.5
  Bottom 0.254: R9.2 45.05,31.31 44.93,31.18 44.93,29.28 44.67,28.89 38.07,28.89 37.69,29.28 37.69,32.45 v37.81,32.58
N$7
  Top 0.61: R2.1 LED1.C
N$9
  Top 0.254: C16.1 36.42,36.3 36.42,30.55 36.93,30.04 40.1,30.04 40.34,30.27 U3.9
N$10
  Top 0.406: R19.2 13.43,26.99 13.68,26.74 14.83,26.74 14.95,26.86 14.95,27.78 U5.1
N$11
  Top 0.61: LED3.C R16.1
N$14
  Top 0.406: LED4.C R19.1
N$18
  Top 0.61: R3.1 LED2.C
PROG
  Top 0.406: R24.1 15.08,31.14 U5.5
RST  (via drill 0.3, 0.41)
  Top 0.305: R4.2 C5.2 | SW2.1 3.76,22.29 R4.2 | R4.2 4.27,22.66 4.41,22.8 v14.57,22.8 | v34.77,25.21 34.77,26.56 U4.29 | v29.31,25.08 26.26,25.08 v25.75,24.58
  Bottom 0.305: v29.31,25.08 34.64,25.08 v34.77,25.21 | v25.75,24.58 25.75,22.29 25.5,22.04 14.83,22.04 14.57,22.29 v14.57,22.8
VBAT  (via drill 0.61)
  Top 0.61: U5.3 16.97,27.89 | D2.A 18.12,36.01 19.4,36.01 19.78,35.63 19.78,29.53 19.26,29.01 C23.1 18.38,29.01 18.38,28.39 17.85,27.85 U5.3 | U5.3 16.92,19.18 17.62,18.48 25.5,18.48 v26.26,17.72
  Bottom 0.61: SW1.1 SW1.4 26.26,11.9 v26.26,17.72
VIN  (via drill 0.41, 0.6)
  Top 0.406: C22.2 16.92,32.12 | IC2.3 5.26,32.03 4.79,31.56 4.79,24.83 4.16,24.2 3.65,24.2 3.27,23.81 v3.27,23.56 | v5.94,16.45 6.7,16.45 7.08,16.07 7.08,14.94 F1.2
  Top 0.61: IC2.3 7.27,33.28 7.84,33.85 8.6,33.85 | IC2.1 9.17,33.41 | 9.17,33.41 8.73,33.85 8.6,33.85 | C4.2 C3.1 8.9,34.14 8.6,33.85 | D2.C 13.43,35.87 LED4.A v12.41,33.58 9.35,33.58 9.17,33.41 | 16.92,32.12 U5.4 | C22.2 17.99,32.18 18.38,32.58 v18.38,33.59
  Bottom 0.406: v3.27,23.56 3.27,17.46 4.29,16.45 v5.94,16.45
  Bottom 0.61: v18.38,33.59 12.55,33.59 v12.41,33.58
XI
  Bottom 0.305: U2.9 8.49,17.22 8.99,17.72 15.29,17.72 15.99,18.41 Q3.3 15.99,17.05 C1.2
XO
  Bottom 0.305: U2.10 7.84,17.59 8.48,18.23 14.7,18.23 14.95,18.48 14.95,19.24 15.46,19.75 17.37,19.75 17.89,20.27 Q3.1 19.08,20.85 C2.2
XTAL1
  Top 0.305: 28.36,17.97 28.36,19.82 28.8,20.26 30.82,20.26 U4.7
XTAL2
  Top 0.305: 30.76,17.97 30.76,19.4 U4.8

### Text on the board
tPlace: G | T | PWR | D13 | R | V | A5 | BT | A4 | RESET | A3 | A2 | MOTIO / GLOVE | A1 | A0 | 08 | 09 | 10 | 11 | 12 | 13 | G / V / S | ON / OFF | + | S / V / G | -
bPlace: (52;27) | Unsoldered 0x28 / Soldered 0x29 | R | T | Mundo Reader SL 2015 | Alvaro Ferrán | Y | X | (8;-2) | (37;-2)